# Altium schematic sheet 3V3Buck_Converter.SchDoc
size 431 x 279 mm
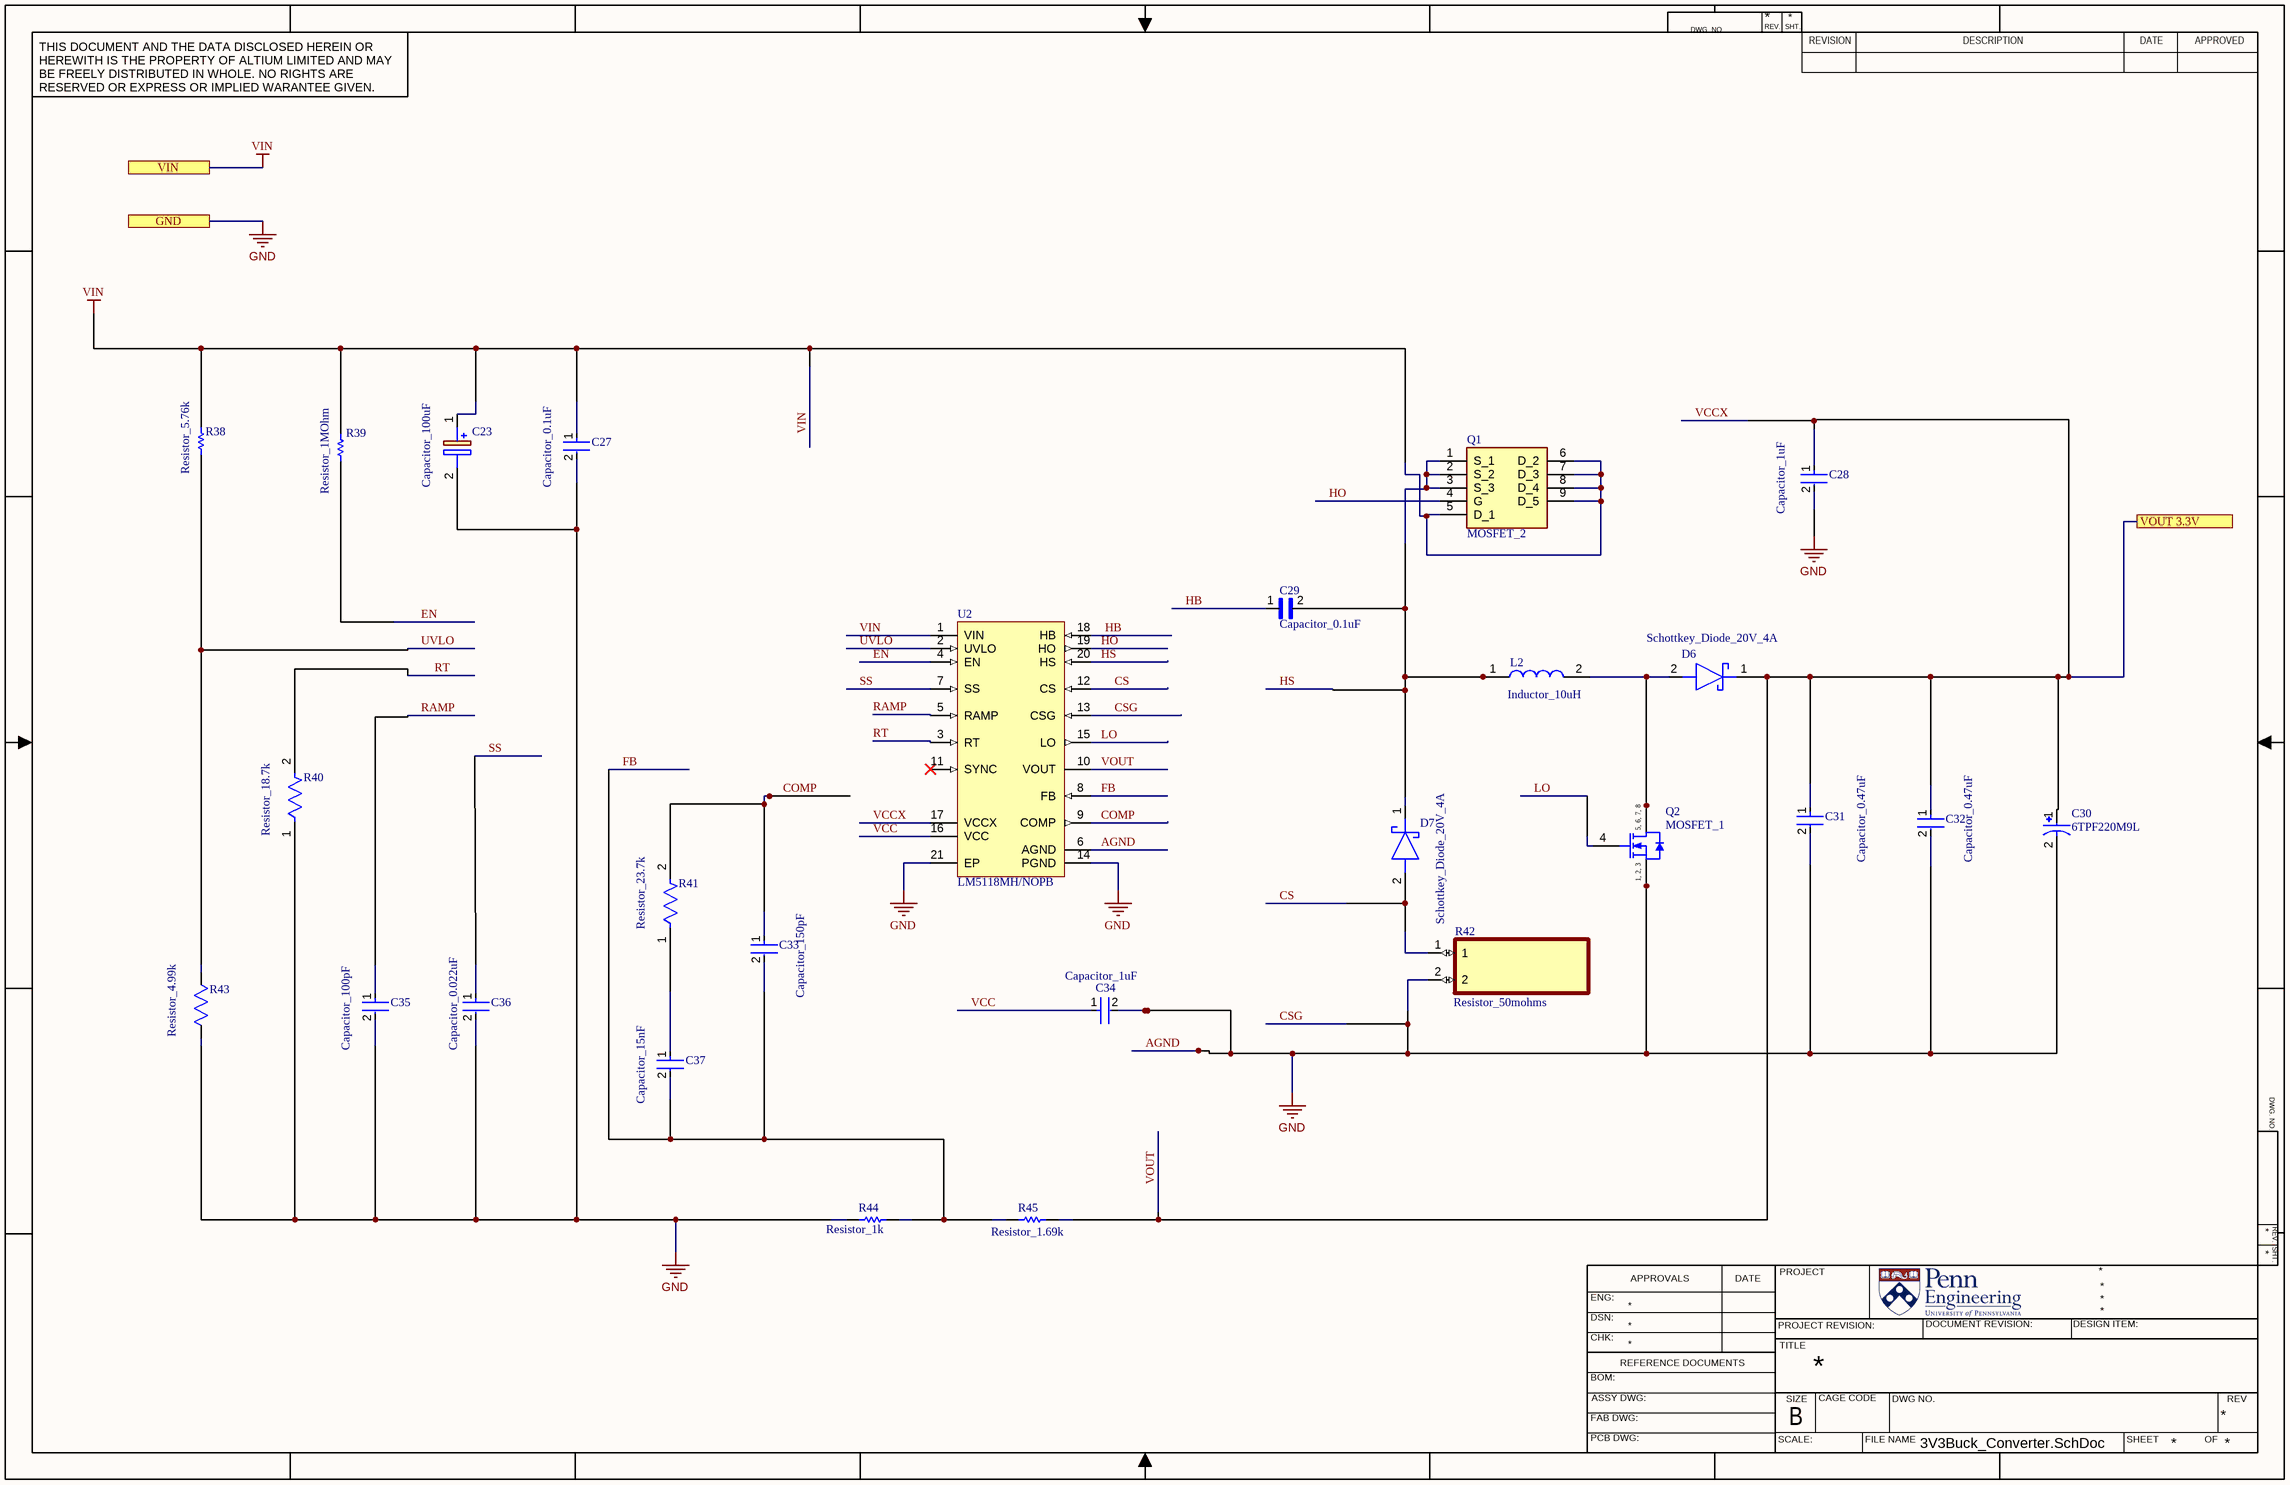
[diagram p0: 3V3Buck_Converter.SchDoc]

## Parts
C23  Capacitor_100uF  [Capacitor_100uF]
C27  Capacitor_0.1uF  [FP-C0805C-DN-MFG]
C28  Capacitor_1uF  [FP-C0603-CG-MFG]
C29  Capacitor_0.1uF  [Capacitor_0.1uF]
C30  6TPF220M9L  [CAP_6TPF220M9L]
C31  Capacitor_0.47uF  [FP-GRM15-0_1-MFG]
C32  Capacitor_0.47uF  [FP-GRM15-0_1-MFG]
C33  Capacitor_150pF  [FP-CL21-IPC_B]
C34  Capacitor_1uF  [FP-C0603-CG-MFG]
C35  Capacitor_100pF  [FP-CL21-IPC_C]
C36  Capacitor_0.022uF  [FP-C2012-125-0_2-IPC_C]
C37  Capacitor_15nF  [FP-CGA4J-IPC_B]
D6  Schottkey_Diode_20V_4A  [Schottkey Diode_20V_4A]
D7  Schottkey_Diode_20V_4A  [Schottkey Diode_20V_4A]
L2  Inductor_10uH  [Inductor_10uH]
Q1  MOSFET_2  [MOSFET_2]
Q2  MOSFET_1  [INF-PG-TDSON-8-1_V]
R38  Resistor_5.76k  [RESC1608X55X25ML10T15]
R39  Resistor_1MOhm  [RESC1608X55X25LL10T15]
R40  Resistor_18.7k  [FP-AC0402-MFG]
R41  Resistor_23.7k  [FP-AC0402-MFG]
R42  Resistor_50mohms  [Resistor_50mohms]
R43  Resistor_4.99k  [Resistor_4.99k]
R44  Resistor_1k  [RESC1608X55X25NL10T15]
R45  Resistor_1.69k  [RESC1609X50X30ML10T20]
U2  LM5118MH/NOPB  [MXA20A_L]

## Ports
GND, VIN, VOUT 3.3V

## Nets
AGND: C23.2(-) C27.2 C28.2 C30.2 C31.2 C32.2 C34.2 C35.2 C36.2 Q2.1(SOURCE) Q2.2(SOURCE) Q2.3(SOURCE) R40.1 R42.2 R43.2(R2) R44.1 U2.6(AGND) U2.13(CSG) U2.14(PGND) U2.21(EP) ; port GND  [also labelled CSG, GND]
VIN: C23.1(+) C27.1 Q1.5(D_1) Q1.6(D_2) Q1.7(D_3) Q1.8(D_4) Q1.9(D_5) R38.2 R39.2 U2.1(VIN) ; port VIN
COMP: C33.1 R41.2 U2.9(COMP)
CS: D7.2(A) R42.1 U2.12(CS)
EN: R39.1 U2.4(EN)
FB: C33.2 C37.2 R44.2 R45.1 U2.8(FB)
HB: C29.1 U2.18(HB)
HO: Q1.4(G) U2.19(HO)
HS: C29.2 D7.1(K) L2.1 Q1.1(S_1) Q1.2(S_2) Q1.3(S_3) U2.20(HS)
LO: Q2.4(GATE) U2.15(LO)
RAMP: C35.1 U2.5(RAMP)
RT: R40.2 U2.3(RT)
SS: C36.1 U2.7(SS)
UVLO: R38.1 R43.1(R1) U2.2(UVLO)
VCC: C34.1 U2.16(VCC)
VCCX: C28.1 C30.1 C31.1 C32.1 D6.1(K) R45.2 U2.10(VOUT) U2.17(VCCX) ; port VOUT 3.3V  [also labelled VOUT]
NetC37_1: C37.1 R41.1
NetD6_2: D6.2(A) L2.2 Q2.5(DRAIN) Q2.6(DRAIN) Q2.7(DRAIN) Q2.8(DRAIN)

Not connected (* = marked no-connect by the designer): U2 11(SYNC)*

## Notes on the sheet
- DWG. NO.
- REV.
- SHT.
- THIS DOCUMENT AND THE DATA DISCLOSED HEREIN OR HEREWITH IS THE PROPERTY OF ALTIUM LIMITED AND MAY BE FREELY DISTRIBUTED IN WHOLE. NO RIGHTS ARE RESERVED OR EXPRESS OR IMPLIED WARANTEE GIVEN.
- REVISION
- DESCRIPTION
- DATE
- APPROVED
- ENG:
- APPROVALS
- PROJECT
- DSN:
- CHK:
- REFERENCE DOCUMENTS
- PROJECT REVISION:
- TITLE
- DOCUMENT REVISION:
- DESIGN ITEM:
- BOM:
- FAB DWG:
- PCB DWG:
- ASSY DWG:
- SCALE:
- SIZE
- B
- CAGE CODE
- FILE NAME
- DWG NO.
- SHEET
- OF
- REV
- (in symbol CMP-1090-00056-1) 5, 6, 7, 8; 1, 2, 3

## Library data of the parts
C23 = Capacitor_100uF: Cap Tant Solid 100uF 10V D CASE 20% (7.3 X 4.3 X 2.8mm) Inward L SMD 7343-31 0.1 Ohm 125C T/R; Manufacturer: Vishay Sprague; Manufacturer Part Number: 593D107X0010D2TE3; ESR (Equivalent Series Resistance): 100mR; Ripple Current: 740mA; Leakage Current: 10uA; Polarity: Polar; Dissipation Factor: 6%; Supplier 1: Digi-Key; Supplier Part Number 1: 718-1100-1-ND; RoHS: Yes; Category: Tantalum Capacitors; Stock 1: 108; Pricing 1: 1=0.90000, 10=0.68800, 50=0.57140, 100=0.49200 (USD); Mount: Surface Mount,PCB; Case/Package: 2917; Number of Pins: 2; Case Code (Metric): 7343; Case Code (Imperial): 2917; Weight: 0.023634oz; Min Operating Temperature: -55°C; Max Operating Temperature: 125°C; Capacitance: 100uF; Tolerance: 20%; Voltage Rating: 10V; Package Quantity: 1; Packaging: Tape and Reel; Voltage Rating (DC): 10V; Termination: SMD/SMT; Voltage: 10V; Features: General Purpose; Series: TANTAMOUNT® 593D; Construction: Flat; Length: 7.3mm; Width: 0.169inch; Height: 3.1mm; Depth: 4.3mm; Height - Seated (Max): 0.122inch; Radiation Hardening: No; REACH SVHC: Unknown; Lead Free: Lead Free; RoHS Compliant: Yes; ComponentLink1URL: https://datasheet.ciiva.com/1463/1598570-1463805.pdf?src-supplier=Element14; ComponentLink1Description: https://datasheet.ciiva.com/1463/1598570-1463805.pdf?src-supplier=Element14; ComponentLink2URL: https://datasheet.ciiva.com/260/593d-260241.pdf?src-supplier=Digi-Key; ComponentLink2Description: https://datasheet.ciiva.com/260/593d-260241.pdf?src-supplier=Digi-Key; ComponentLink3URL: https://datasheet.ciiva.com/260/593d-260242.pdf?src-supplier=Digi-Key; ComponentLink3Description: https://datasheet.ciiva.com/260/593d-260242.pdf?src-supplier=Digi-Key; ComponentLink4URL: https://datasheet.ciiva.com/260/593d-260243.pdf?src-supplier=Digi-Key; ComponentLink4Description: https://datasheet.ciiva.com/260/593d-260243.pdf?src-supplier=Digi-Key; ComponentLink5URL: https://datasheet.ciiva.com/3004/593d-3004057.pdf?src-supplier=Avnet; ComponentLink5Description: https://datasheet.ciiva.com/3004/593d-3004057.pdf?src-supplier=Avnet; ComponentLink6URL: https://datasheet.ciiva.com/12882/593d-239975-12882744.pdf?src-supplier=Mouser; ComponentLink6Description: https://datasheet.ciiva.com/12882/593d-239975-12882744.pdf?src-supplier=Mouser; ComponentLink7URL: https://datasheet.ciiva.com/22644/593d-22644537.pdf?src-supplier=Element14; ComponentLink7Description: https://datasheet.ciiva.com/22644/593d-22644537.pdf?src-supplier=Element14; ComponentLink8URL: https://datasheet.ciiva.com/46382/1910926-46382106.pdf?src-supplier=Element14; ComponentLink8Description: https://datasheet.ciiva.com/46382/1910926-46382106.pdf?src-supplier=Element14; ComponentLink9URL: https://datasheet.ciiva.com/15163/getdatasheetpartid-88232-15163238.pdf?src-supplier=Verical; ComponentLink9Description: https://datasheet.ciiva.com/15163/getdatasheetpartid-88232-15163238.pdf?src-supplier=Verical; ComponentLink10URL: https://datasheet.ciiva.com/16632/593d-16632317.pdf?src-supplier=Avnet+Europe; ComponentLink10Description: https://datasheet.ciiva.com/16632/593d-16632317.pdf?src-supplier=Avnet+Europe
C27 = CMP-1036-04423-3: CAP CER 0.1UF 50V X7R 0805; Manufacturer Part Number: C0805C104M5RACTU; Manufacturer: KEMET; Tolerance: 0.2; Temperature Coefficient: 30ppm/°C; Material: Ceramic; Capacitance: 0.10 μF; Value: 0.10 μF; Temperature: -55°C to +125°C; RoHS: TRUE; Temperature Range Low: -55°C; Device Class L3: Ceramic Capacitors; Octopart: https://octopart.com/c0805c104m5ractu-kemet-129379; Ipc Land Pattern Name: CAPC200125X78; Mouser Description: Multilayer Ceramic Capacitors MLCC - SMD/SMT 50volts 0.1uF X7R 20%; Temperature Range High: +125°C; Package: C0805C-DN; Temperature Characteristic: X7R; Automotive: No; ComponentLink2URL: https://content.kemet.com/datasheets/KEM_C1003_C0G_SMD.pdf; Device Class L1: Passive Components; ComponentLink2Description: Datasheet; Device Class L2: Capacitors; Voltage Rating: 50 V; Digikey Description: CAP CER 0.1UF 50V X7R 0805; Lead Free: Yes; Height: 0.88mm; Category: Cap
C28 C34 = CMP-2006-02243-2: CAP CER 1UF 10V Y5V 0603; Dielectric Material: Ceramic; Tolerance: 80%; Dissipation Factor: 10%; Case/Package: 0603; Width: 0.8mm; Radiation Hardening: No; Lead Pitch: 0.7mm; Termination: SMD/SMT; Min Operating Temperature: -30°C; Voltage Rating (DC): 10V; Length: 1.6mm; Packaging: Tape and Reel; Mount: Surface Mount; REACH SVHC: No SVHC; Series: C; Case Code (Imperial): 0603; Package Quantity: 1; Thickness: 0.035inch; Capacitance: 1uF; Height: 0.8mm; Dielectric: Y5V; Construction: Flat; Lead Free: Lead Free; Case Code (Metric): 1608; Max Operating Temperature: 85°C; Voltage Rating: 10V; Depth: 0.8mm; RoHS Compliant: Yes
C29 = Capacitor_0.1uF: Cap Ceramic 0.1uF 25V X7R 5% SMD 0805 FlexiTerm 125°C Paper T/R; Manufacturer: Kyocera AVX; Manufacturer Part Number: 08053C104JAZ2A; Capacitance: 100nF; Supplier 1: Digi-Key; Supplier Part Number 1: 478-11877-1-ND; RoHS: Yes; Category: Ceramic Capacitors; Stock 1: 3816; Pricing 1: 1=0.37000, 10=0.25400, 50=0.17780, 100=0.15250, 500=0.11434, 1000=0.09656 (USD); Mount: Surface Mount; Case/Package: 0805; Number of Pins: 2; Case Code (Imperial): 0805; Case Code (Metric): 2012; Min Operating Temperature: -55°C; Max Operating Temperature: 125°C; Package Quantity: 4000; Voltage Rating: 25V; Voltage Rating (DC): 25V; Tolerance: 5%; Packaging: Tape and Reel; Dielectric: X7R; Termination: SMD/SMT; Features: Soft Termination; Series: FLEXITERM®; Construction: Flat; Length: 2.01mm; Width: 1.25mm; Height: 0.94mm; Thickness: 0.037inch; Depth: 1.25mm; RoHS Compliant: Yes; ComponentLink1URL: https://datasheet.ciiva.com/208/flexiterm-208638.pdf?src-supplier=Digi-Key; ComponentLink1Description: https://datasheet.ciiva.com/208/flexiterm-208638.pdf?src-supplier=Digi-Key; ComponentLink2URL: https://datasheet.ciiva.com/11504/flexiterm-11504238.pdf?src-supplier=Avnet; ComponentLink2Description: https://datasheet.ciiva.com/11504/flexiterm-11504238.pdf?src-supplier=Avnet; ComponentLink3URL: https://datasheet.ciiva.com/5423/cx7r-218113-5423549.pdf?src-supplier=Mouser; ComponentLink3Description: https://datasheet.ciiva.com/5423/cx7r-218113-5423549.pdf?src-supplier=Mouser
C30 = 6TPF220M9L: MF: {'manufacturer': u'Panasonic'}; Value: *; Price: None; Availability: Unavailable; Package: None; MP: 6TPF220M9L
C31 C32 = CMP-2000-05009-2: CAP CER 0.47UF 10V X5R 0402; Manufacturer: Murata Electronics North America; Manufacturer Part Number: GRM155R61A474KE15D; Temperature Coefficient: 15%; Material: Ceramic; Tolerance: 10%; Device Class L3: Ceramic Capacitors; ComponentLink2Description: Datasheet; ComponentLink2URL: https://search.murata.co.jp/Ceramy/image/img/A01X/G101/ENG/GRM155R61A474KE15-01A.pdf; Package: GRM15-0.1; Voltage Rating: 10V; Capacitance: 0.47uF; Category: Cap; Temperature Range High: +85°C; Temperature Range Low: -55°C; Height: 0.55mm; Device Class L2: Capacitors; Lead Free: Yes; Mouser Description: Multilayer Ceramic Capacitors MLCC - SMD/SMT 0402 0.47uF 10volts X5R 10%; Ipc Land Pattern Name: CAPC10050X50; Temperature Characteristic: X5R; Digikey Description: CAP CER 0.47UF 10V X5R 0402; Value: 0.47uF; Octopart: https://octopart.com/grm155r61a474ke15d-murata-196883; Automotive: No; Device Class L1: Passive Components; Temperature: -55°C to +85°C; RoHS: TRUE
C33 = CMP-13271-003387-1: CL21 Series 0805 150pF 50V ±5% Tolerance C0G Multilayer Ceramic Chip Capacitor; Height: 0.65mm; Case Code (Metric): 2012; Material: Ceramic; Voltage Rating: 50V; Length: 2mm; Package Quantity: 1; Mount: Surface Mount; Case Code (Imperial): 0805; Depth: 1.25mm; Dielectric: C0G; Contact Plating: Tin; Thickness: 0.03inch; Case/Package: 0805; Max Operating Temperature: 125°C; Min Operating Temperature: -55°C; Tolerance: 5%; Packaging: Tape and Reel; Radiation Hardening: No; Voltage: 50V; Capacitance: 150pF; Width: 0.049inch
C35 = CMP-13271-001949-1: CL21 Series 0805 100pF 50V ±5% Tolerance C0G Multilayer Ceramic Chip Capacitor; Temperature Coefficient: 300ppm/°C; Voltage Rating (DC): 50V; Material: Ceramic; Capacitance: 100pF; Height: 0.65mm; Thickness: 0.03inch; Case/Package: 0805; Voltage Rating: 50V; Max Operating Temperature: 125°C; Voltage: 50V; Dielectric: C0G; Length: 2mm; Case Code (Metric): 2012; Packaging: Tape and Reel; Tolerance: 5%; Min Operating Temperature: -55°C; Radiation Hardening: No; Lead Free: Lead Free; Contact Plating: Tin; Width: 0.049inch; Mount: Surface Mount; Case Code (Imperial): 0805; Depth: 1.25mm
C36 = CMP-08246-002695-1: CAP CER 0.022UF 50V C0G 0805; Capacitance: 22nF; Tolerance: 5%; Dielectric Material: Ceramic; Temperature Coefficient: 30ppm/°C; Max Operating Temperature: 125°C; Voltage Rating: 50V; Packaging: Tape and Reel; Dielectric: C0G; Voltage Rating (DC): 50V; Package Quantity: 1; Case/Package: 0805; REACH SVHC: No SVHC; Weight: 0.000194oz; Length: 2mm; Case Code (Imperial): 0805; Height: 1.25mm; Series: C; Termination: SMD/SMT; Width: 0.049inch; Min Operating Temperature: -55°C; Lead Free: Lead Free; RoHS Compliant: Yes; Mount: Surface Mount; Thickness: 0.057inch; Radiation Hardening: No; Depth: 1.25mm; Voltage: 50V; Case Code (Metric): 2012; Construction: Flat
C37 = CMP-08246-000331-1: Cap Ceramic 15nF 50V C0G 5% Pad SMD 0805 +125°C Automotive T/R; Weight: 0.000194oz; Width: 0.049inch; Tolerance: 5%; REACH SVHC: No SVHC; Voltage Rating (DC): 50V; Case Code (Imperial): 0805; Depth: 1.25mm; Voltage Rating: 50V; Case Code (Metric): 2012; Thickness: 0.037inch; Height: 0.85mm; Max Operating Temperature: 125°C; Termination: SMD/SMT; Packaging: Tape and Reel; Mount: Surface Mount; Dielectric: C0G; Package Quantity: 1; Case/Package: 0805; Ratings: AEC-Q200; Capacitance: 15nF; Composition: Ceramic; Lead Free: Lead Free; Length: 2mm; Min Operating Temperature: -55°C
D6 D7 = Schottkey_Diode_20V_4A: SL42 Series 20 V 2 A Surface Mount Schottky Barrier Rectifier - DO-214AB (SMC); Manufacturer: ON Semiconductor; Manufacturer Part Number: MBRS320T3; Max Surge Current: 80A; Average Rectified Current: 4A; Element Configuration: Single; Polarity: Standard; Voltage Rating (DC): 20V; Current Rating: 3A; Max Reverse Leakage Current: 2mA; Forward Voltage: 470mV; Max Reverse Current: 500uA; Peak Non-Repetitive Surge Current: 150A; Supplier 1: Digi-Key; Supplier Part Number 1: MBRS320T3OSCT-ND; RoHS: No; Category: Schottky Diodes; Case/Package: SMC; Number of Pins: 2; Min Operating Temperature: -65°C; Max Operating Temperature: 125°C; Package Quantity: 1; Packaging: Tape and Reel; Output Current: 3A; Max Reverse Voltage (DC): 20V; Max Forward Surge Current (Ifsm): 80A; Series: -; Lead Free: Contains Lead; RoHS Compliant: No; ComponentLink1URL: https://datasheet.ciiva.com/4719/mbrs340t3-d-302035-4719013.pdf?src-supplier=Mouser; ComponentLink1Description: https://datasheet.ciiva.com/4719/mbrs340t3-d-302035-4719013.pdf?src-supplier=Mouser; ComponentLink2URL: https://datasheet.ciiva.com/927/mbrs340t3-d-927080.pdf?src-supplier=Digi-Key; ComponentLink2Description: https://datasheet.ciiva.com/927/mbrs340t3-d-927080.pdf?src-supplier=Digi-Key; Supplier 2: Digi-Key; Supplier Part Number 2: SL42-E3/57TGICT-ND; Stock 2: 402; Pricing 2: 1=1.01000, 10=0.88500, 100=0.67820 (USD); Mount: Surface Mount; Forward Current: 4A; Max Repetitive Reverse Voltage (Vrrm): 20V; Radiation Hardening: No; REACH SVHC: Unknown; ComponentLink3URL: https://datasheet.ciiva.com/4714/88742-103296-4714672.pdf?src-supplier=Mouser; ComponentLink3Description: https://datasheet.ciiva.com/4714/88742-103296-4714672.pdf?src-supplier=Mouser; ComponentLink4URL: https://datasheet.ciiva.com/4246/sl42-4246044.pdf?src-supplier=Arrow+Electronics; ComponentLink4Description: https://datasheet.ciiva.com/4246/sl42-4246044.pdf?src-supplier=Arrow+Electronics; ComponentLink5URL: https://datasheet.ciiva.com/23793/1691224-23793280.pdf?src-supplier=Newark; ComponentLink5Description: https://datasheet.ciiva.com/23793/1691224-23793280.pdf?src-supplier=Newark; ComponentLink6URL: https://datasheet.ciiva.com/16355/sl42-16355184.pdf?src-supplier=Future+Electronics; ComponentLink6Description: https://datasheet.ciiva.com/16355/sl42-16355184.pdf?src-supplier=Future+Electronics; ComponentLink7URL: https://datasheet.ciiva.com/25937/sl42-25937965.pdf?src-supplier=Avnet+Europe; ComponentLink7Description: https://datasheet.ciiva.com/25937/sl42-25937965.pdf?src-supplier=Avnet+Europe
L2 = Inductor_10uH: Inductor Power Semi-Shielded Wirewound 10uH 20% 100KHz 17Q-Factor Ferrite 2.5A 58.6mOhm DCR T/R; Manufacturer: Bourns; Manufacturer Part Number: SRN6045-100M; Material: Steel; DC Resistance (DCR): 58.6mR; Saturation Current: 3A; Self Resonant Frequency: 15MHz; Supplier 1: Digi-Key; Supplier Part Number 1: SRN6045-100MCT-ND; RoHS: Yes; Category: Fixed Inductors; Stock 1: 1938; Pricing 1: 1=0.62000, 10=0.54400, 25=0.50520, 50=0.42740, 100=0.38860, 250=0.36528, 500=0.32640 (USD); Mount: Surface Mount; Case/Package: Nonstandard; Number of Pins: 2; Core Material: Ferrite; Weight: 0.027725oz; Min Operating Temperature: -40°C; Max Operating Temperature: 125°C; Tolerance: 20%; Inductance: 10uH; Max DC Current: 2.5A; Package Quantity: 1; Current Rating: 2.5A; Shielding: Shielded; Packaging: Tape and Reel; Inductance Tolerance: 20%; Resistor Type: Wirewound; Test Frequency: 100kHz; Termination: SMD/SMT; RMS Current (Irms): 2.5A; DC Current: 2.5A; Series: SRN6045; Sample Rate (Hz): 100kHz; Length: 6mm; Width: 6mm; Height: 4.5mm; Height - Seated (Max): 0.177inch; Depth: 6.2mm; REACH SVHC: No SVHC; Military Standard: Not; RoHS Compliant: Yes; ComponentLink1URL: https://datasheet.ciiva.com/11802/0900766b80fe1f3e-11802575.pdf?src-supplier=RSComponents; ComponentLink1Description: https://datasheet.ciiva.com/11802/0900766b80fe1f3e-11802575.pdf?src-supplier=RSComponents; ComponentLink2URL: https://datasheet.ciiva.com/6689/srn6045-6689370.pdf?src-supplier=Digi-Key; ComponentLink2Description: https://datasheet.ciiva.com/6689/srn6045-6689370.pdf?src-supplier=Digi-Key; ComponentLink3URL: https://datasheet.ciiva.com/6689/srn6045-6689372.pdf?src-supplier=Digi-Key; ComponentLink3Description: https://datasheet.ciiva.com/6689/srn6045-6689372.pdf?src-supplier=Digi-Key; ComponentLink4URL: https://datasheet.ciiva.com/6689/srn6045-6689374.pdf?src-supplier=Digi-Key; ComponentLink4Description: https://datasheet.ciiva.com/6689/srn6045-6689374.pdf?src-supplier=Digi-Key; ComponentLink5URL: https://datasheet.ciiva.com/8512/srn6045-8512981.pdf?src-supplier=Avnet; ComponentLink5Description: https://datasheet.ciiva.com/8512/srn6045-8512981.pdf?src-supplier=Avnet; ComponentLink6URL: https://datasheet.ciiva.com/7849/1875285-7849518.pdf?src-supplier=Element14; ComponentLink6Description: https://datasheet.ciiva.com/7849/1875285-7849518.pdf?src-supplier=Element14; ComponentLink7URL: https://datasheet.ciiva.com/17113/70231653-17113272.pdf?src-supplier=Allied+Electronics; ComponentLink7Description: https://datasheet.ciiva.com/17113/70231653-17113272.pdf?src-supplier=Allied+Electronics; ComponentLink8URL: https://datasheet.ciiva.com/28561/1875285-28561101.pdf?src-supplier=Element14; ComponentLink8Description: https://datasheet.ciiva.com/28561/1875285-28561101.pdf?src-supplier=Element14; ComponentLink9URL: https://datasheet.ciiva.com/17284/srn6045-17284746.pdf?src-supplier=Avnet+Europe; ComponentLink9Description: https://datasheet.ciiva.com/17284/srn6045-17284746.pdf?src-supplier=Avnet+Europe; ComponentLink10URL: https://datasheet.ciiva.com/48691/001056442-da-01-en-mag-abg-leist-ind-srn6045-100m-10uh-smd-48691818.pdf?src-supplier=Conrad; ComponentLink10Description: https://datasheet.ciiva.com/48691/001056442-da-01-en-mag-abg-leist-ind-srn6045-100m-10uh-smd-48691818.pdf?src-supplier=Conrad
Q1 = MOSFET_2: 25-V, N channel NexFET™ power MOSFET, single SON 5 mm x 6 mm, 5.5 mOhm 8-VSONP -55 to 150; Manufacturer: Texas Instruments; Manufacturer Part Number: CSD16342Q5A; Rds On Max: 4.7mR; Drain to Source Voltage (Vdss): 25V; Continuous Drain Current (ID): 100A; Max Power Dissipation: 3W; Input Capacitance: 1.35nF; Rise Time: 16.6ns; Drain to Source Resistance: 3.8mR; Number of Elements: 1; Gate to Source Voltage (Vgs): 10V; Threshold Voltage: 850mV; Turn-On Delay Time: 5.2ns; Turn-Off Delay Time: 13.4ns; Fall Time: 3.1ns; Polarity: N-CHANNEL; Supplier 1: Digi-Key; Supplier Part Number 1: 296-30314-1-ND; RoHS: Yes; Category: Integrated Circuits (ICs); Stock 1: 6285; Pricing 1: 1=1.22000, 10=1.08700, 100=0.84760, 500=0.70016, 1000=0.58625 (USD); Mount: Surface Mount; Case/Package: SON; Number of Pins: 8; Contact Plating: Tin; Min Operating Temperature: -55°C; Max Operating Temperature: 150°C; Packaging: Tape and Reel; Series: NexFET™; Package Quantity: 1; Power Dissipation: 3W; Element Configuration: Single; Length: 5.8mm; Width: 5mm; Height: 1.1mm; Radiation Hardening: No; REACH SVHC: No SVHC; Lead Free: Contains Lead; RoHS Compliant: Yes; ComponentLink1URL: https://datasheet.ciiva.com/6387/csd16342q5a-6387160.pdf?src-supplier=Digi-Key; ComponentLink1Description: https://datasheet.ciiva.com/6387/csd16342q5a-6387160.pdf?src-supplier=Digi-Key; ComponentLink2URL: https://datasheet.ciiva.com/4444/slps369a-128079-4444253.pdf?src-supplier=Mouser; ComponentLink2Description: https://datasheet.ciiva.com/4444/slps369a-128079-4444253.pdf?src-supplier=Mouser; ComponentLink3URL: https://datasheet.ciiva.com/6387/csd16342q5a-6387162.pdf?src-supplier=Digi-Key; ComponentLink3Description: https://datasheet.ciiva.com/6387/csd16342q5a-6387162.pdf?src-supplier=Digi-Key; ComponentLink4URL: https://datasheet.ciiva.com/6387/csd16342q5a-6387165.pdf?src-supplier=Digi-Key; ComponentLink4Description: https://datasheet.ciiva.com/6387/csd16342q5a-6387165.pdf?src-supplier=Digi-Key; ComponentLink5URL: https://datasheet.ciiva.com/14192/csd16342q5a-14192879.pdf?src-supplier=Avnet; ComponentLink5Description: https://datasheet.ciiva.com/14192/csd16342q5a-14192879.pdf?src-supplier=Avnet
Q2 = CMP-1090-00056-1: N-Channel OptiMOS 2 Power-Transistor, 20 V VDS, 80 A ID, -55 to 150 degC, PG-TDSON-8-1, Reel, Green; PartNumber: BSC046N02KS G; Manufacturer: Infineon; IDpuls (max): 200Â A; VGS(th) (max): 1.2Â V; ID (max): 80Â A; RDS (on) (max) (@4.5V): 4.6Â mOhm; VGS(th) (min): 0.7Â V; RthJA (max): 62 K/W; QG: 21Â nC; RthJC (max): 2.6Â K/W; Polarity: N; VDS (max): 20Â V; Green: TRUE; Ptot (max): 48Â W; Halogen-free: TRUE; PackageDescription: 8-Pin Plastic (Green) Thin Dual Small Outline Non-Leaded Package, 5.15 x 5.9 mm Body, 1.27 mm Pitch; ComponentLink1URL: http://www.infineon.com/; PackageReference: PG-TDSON-8-1; ComponentLink3Description: Package Specification; Mounting Technology: Surface Mount; ComponentLink3URL: http://www.infineon.com/cms/packages/SMD_-_Surface_Mounted_Devices/P-PG-TDSON/P-PG-TDSON-08-01x_2x_3.html?__locale=en; ComponentLink1Description: Manufacturer URL; ComponentLink2Description: Datasheet; DatasheetVersion: Rev. 1.06; Packing: Reel; Rth: 2.6Â K/W; ComponentLink2URL: http://www.infineon.com/dgdl/BSC046N02KS+G+Rev16.pdf?folderId=db3a3043163797a6011637c252b10018&fileId=db3a3043163797a6011637c34414001c
R38 = CMP-2000-04094-1: RES 5.76K OHM 1% 1/10W 0603; Part Number: RC0603FR-075K76L; Manufacturer: Yageo
R39 = CMP-1659-00056-1: Chip Resistor, 1 MOhm, +/- 1%, 100 mW, -55 to 155 degC, 0603 (1608 Metric), RoHS, Tape and Reel; Voltage Rating (DC): 25 V; Tolerance: 20%; Case\Package: Radial; Capacitance: 1 mF; Min Operating Temperature: -40 degC; PackageDescription: 2-Pin Surface Mount Device, Body 1.6 x 0.8 mm; ComponentLink1Description: Manufacturer URL; Radiation Hardening: No; DatasheetVersion: Rev. 4, 02/2016; REACH SVHC: No SVHC; Length: 20 mm; Max Operating Temperature: 85 degC; Diameter: 10 mm; Packaging: Bulk; Package Quantity: 200; PackageReference: 0603; Mount: Through Hole; ComponentLink1URL: http://www.yageo.com/; ComponentLink2URL: http://www.yageo.com/documents/recent/PYu-RC_Group_51_RoHS_L_04.pdf; ComponentLink2Description: Datasheet; Width: 0 inch; Lead Pitch: 5 mm; RoHSCompliant: true; Voltage Rating: 25 V; Height: 20 mm
R40 = CMP-03412-024020-1: RES SMD 18.7K OHM 1% 1/16W 0402; Manufacturer: Yageo; Manufacturer Part Number: AC0402FR-0718K7L; Power Rating: 0.0625W; Voltage Rating: 50V; Tolerance: 0.01; Resistance: 18.7KΩ; Automotive Grade: Grade 0; Value: 18.7KΩ; Octopart: https://octopart.com/ac0402fr-0718k7l-yageo-71366607; Device Class L1: Passive Components; Digikey Description: RES SMD 18.7K OHM 1% 1/16W 0402; Composition: Thick Film; Device Class L3: Chip SMD Resistors; Series: AC; Footprint Url: http://www.yageo.com/exep/pages/download/literatures/PYu-R_Mount_10.pdf; RoHS: TRUE; Ipc Land Pattern Name: RESC10050X32; ComponentLink2Description: Datasheet; Temperature Range High: +155°C; Package: AC0402; Automotive: Yes; Device Class L2: Resistors; ComponentLink2URL: http://www.yageo.com/documents/recent/PYu-AC_51_RoHS_L_6.pdf; Temperature: -55°C to +155°C; Height: 0.37mm; Lead Free: Yes; Category: Res; Temperature Range Low: -55°C
R41 = CMP-03412-035105-1: RES SMD 23.7K OHM 1% 1/16W 0402; Manufacturer Part Number: AC0402FR-0723K7L; Manufacturer: Yageo; Power Rating: 0.0625W; Value: 23.7KΩ; Voltage Rating: 50V; Tolerance: 0.01; Automotive Grade: Grade 0; Device Class L3: Chip SMD Resistors; Device Class L2: Resistors; Octopart: https://octopart.com/ac0402fr-0723k7l-yageo-71366670; Composition: Thick Film; Mouser Description: Thick Film Resistors - SMD 1/16W 23.7K ohm 1% AEC-Q200; Lead Free: Yes; Height: 0.37mm; Temperature: -55°C to +155°C; Temperature Range High: +155°C; Device Class L1: Passive Components; Package: AC0402; Digikey Description: RES SMD 23.7K OHM 1% 1/16W 0402; Temperature Range Low: -55°C; Footprint Url: http://www.yageo.com/exep/pages/download/literatures/PYu-R_Mount_10.pdf; ComponentLink2Description: Datasheet; Automotive: Yes; ComponentLink2URL: http://www.yageo.com/documents/recent/PYu-AC_51_RoHS_L_6.pdf; Category: Res; Ipc Land Pattern Name: RESC10050X32; RoHS: TRUE; Resistance: 23.7KΩ; Series: AC
R42 = Resistor_50mohms: Res Thick Film 0805 50m Ohm 1% 1/4W ±100ppm/°C Molded SMD T/R; Manufacturer: Bourns; Manufacturer Part Number: CRM0805-FW-R050ELF; Resistance: 50mR; Power Rating: 250mW; Voltage Rating: 477mV; Temperature Coefficient: 200ppm/°C; Supplier 1: Digi-Key; Supplier Part Number 1: CRM0805-FW-R050ELFCT-ND; RoHS: Yes; Category: Chip SMD Resistors; Stock 1: 4738; Pricing 1: 1=0.67000, 10=0.56000, 25=0.48000, 50=0.43200, 100=0.37600, 250=0.33600, 500=0.27200, 1000=0.22000 (USD); Case/Package: 0805; Number of Pins: 2; Case Code (Metric): 2012; Case Code (Imperial): 0805; Min Operating Temperature: -55°C; Max Operating Temperature: 155°C; Packaging: Tape and Reel; Package Quantity: 1; Tolerance: 1%; Resistor Type: Thick Film; Number of Terminations: 2; Max Power Dissipation: 250mW; Series: CRM0805; Resistance Tolerance: 1%; Length: 0.079inch; Width: 0.047inch; Height: 0.024inch; REACH SVHC: No SVHC; RoHS Compliant: Yes; ComponentLink1URL: https://datasheet.ciiva.com/6564/crm0805-1206-2010-6564006.pdf?src-supplier=Digi-Key; ComponentLink1Description: https://datasheet.ciiva.com/6564/crm0805-1206-2010-6564006.pdf?src-supplier=Digi-Key; ComponentLink2URL: https://datasheet.ciiva.com/6564/crm0805-1206-2010-6564007.pdf?src-supplier=Digi-Key; ComponentLink2Description: https://datasheet.ciiva.com/6564/crm0805-1206-2010-6564007.pdf?src-supplier=Digi-Key; ComponentLink3URL: https://datasheet.ciiva.com/6564/crm0805-1206-2010-6564008.pdf?src-supplier=Digi-Key; ComponentLink3Description: https://datasheet.ciiva.com/6564/crm0805-1206-2010-6564008.pdf?src-supplier=Digi-Key; ComponentLink4URL: https://datasheet.ciiva.com/7985/1859481-7985934.pdf?src-supplier=Element14; ComponentLink4Description: https://datasheet.ciiva.com/7985/1859481-7985934.pdf?src-supplier=Element14; ComponentLink5URL: https://datasheet.ciiva.com/22693/1859481-22693285.pdf?src-supplier=Element14; ComponentLink5Description: https://datasheet.ciiva.com/22693/1859481-22693285.pdf?src-supplier=Element14
R43 = Resistor_4.99k: Res General Purpose Thick Film 0603 4.99k Ohm 1% 1/10W ±100ppm/°C Molded Paper T/R; Manufacturer: Yageo; Manufacturer Part Number: RC0603FR-074K99L; Resistance: 4.99kR; Voltage Rating: 75V; Power Rating: 100mW; Voltage Rating (DC): 50V; Supplier 1: Digi-Key; Supplier Part Number 1: 311-4.99KHRCT-ND; RoHS: Yes; Category: Chip SMD Resistors; Stock 1: 343463; Pricing 1: 1=0.10000, 10=0.02400, 100=0.00970, 1000=0.00436, 2500=0.00378 (USD); Case/Package: 0603; Number of Pins: 2; Case Code (Imperial): 0603; Case Code (Metric): 1608; Weight: 7.1E-05oz; Size Code: 0603; Min Operating Temperature: -55°C; Max Operating Temperature: 155°C; Tolerance: 1%; Resistor Type: Thick Film; Temperature Coefficient: 100ppm/°C; Packaging: Tape and Reel; Package Quantity: 1; Termination: SMD/SMT; Number of Terminations: 2; Max Power Dissipation: 100mW; Features: Moisture Resistant; Series: RC; Construction: Rectangular; Resistance Tolerance: 1%; Length: 1.6mm; Width: 0.8mm; Height: 0.022inch; Depth: 0.8mm; REACH SVHC: Unknown; Military Standard: Not; Lead Free: Lead Free; RoHS Compliant: Yes; ComponentLink1URL: https://datasheet.ciiva.com/2453/pyu-r-int-thick-7-2453979.pdf?src-supplier=Digi-Key; ComponentLink1Description: https://datasheet.ciiva.com/2453/pyu-r-int-thick-7-2453979.pdf?src-supplier=Digi-Key; ComponentLink2URL: https://datasheet.ciiva.com/2453/pyu-r-int-thick-7-2453980.pdf?src-supplier=Digi-Key; ComponentLink2Description: https://datasheet.ciiva.com/2453/pyu-r-int-thick-7-2453980.pdf?src-supplier=Digi-Key; ComponentLink3URL: https://datasheet.ciiva.com/2453/pyu-r-int-thick-7-2453981.pdf?src-supplier=Digi-Key; ComponentLink3Description: https://datasheet.ciiva.com/2453/pyu-r-int-thick-7-2453981.pdf?src-supplier=Digi-Key; ComponentLink4URL: https://datasheet.ciiva.com/7983/443971-7983646.pdf?src-supplier=Element14; ComponentLink4Description: https://datasheet.ciiva.com/7983/443971-7983646.pdf?src-supplier=Element14; ComponentLink5URL: https://datasheet.ciiva.com/22747/443971-22747529.pdf?src-supplier=Element14; ComponentLink5Description: https://datasheet.ciiva.com/22747/443971-22747529.pdf?src-supplier=Element14
R44 = CMP-1659-00009-4: Chip Resistor, 1 KOhm, +/-1%, 0.1 W, -55 to 155 degC, 0603 (1608 Metric), RoHS, Tape and Reel; Manufacturer: Yageo; Voltage Rating: 50 V; ComponentLink2URL: http://www.yageo.com/documents/recent/PYu-RC_Group_51_RoHS_L_04.pdf; Max Operating Temperature: 155 degC; PackageDescription: 2-Pin Surface Mount Device, Body 1.6 x 0.8 mm; Packaging: Tape and Reel; ComponentLink3Description: Package Specification; REACH SVHC: No SVHC; Mount: Surface Mount; ComponentLink2Description: Datasheet; Length: 1.6 mm; PackageReference: 0603; Height: 0.45 mm; DatasheetVersion: Rev. 4, 02/2016; Min Operating Temperature: -55 degC; ComponentLink1Description: Manufacturer URL; Package Quantity: 200; RoHSCompliant: true; ComponentLink3URL: http://www.farnell.com/datasheets/443971.pdf; Pins: 2; Mounting Technology: Surface Mount; ComponentLink1URL: http://www.yageo.com/
R45 = CMP-2000-03004-1: RES SMD 1.69K OHM 1% 1/10W 0603; Manufacturer: Vishay Dale; Part Number: CRCW06031K69FKEA
U2 = CMP-0069-01496-2: Wide Voltage Range Buck-Boost Controller, 20-pin TSSOP-EP, Pb-Free; Manufacturer: National Semiconductor; CompType: Switcher; PackageTopMarking: NSUZXYTT*LM5118*MH; PowerWise: Y; PackageVersion: revC, Jul-2006; ComponentLink3Description: MXA20A Package Page; RoHS: Y; ComponentLink1Description: LM5118 Datasheet; PackageDescription: Molded TSSOP, Jedec, 6.5 x 4.4 x 0.9mm Body, 20 Lead, 0.65mm Pitch, Exposed Pad; ComponentLink1URL: http://www.national.com/ds/LM/LM5118.pdf; ComponentLink2URL: http://www.national.com/pf/LM/LM5118.html; Code_JEDEC: MO-153-ACT; PinCount: 20; RevisionNote: Component URLs added; DatasheetVersion: Jul-2009; ComponentLink3URL: http://www.national.com/packaging/folders/mxa20a.html; ComponentLink2Description: LM5118 Web Page; PackageReference: MXA20A